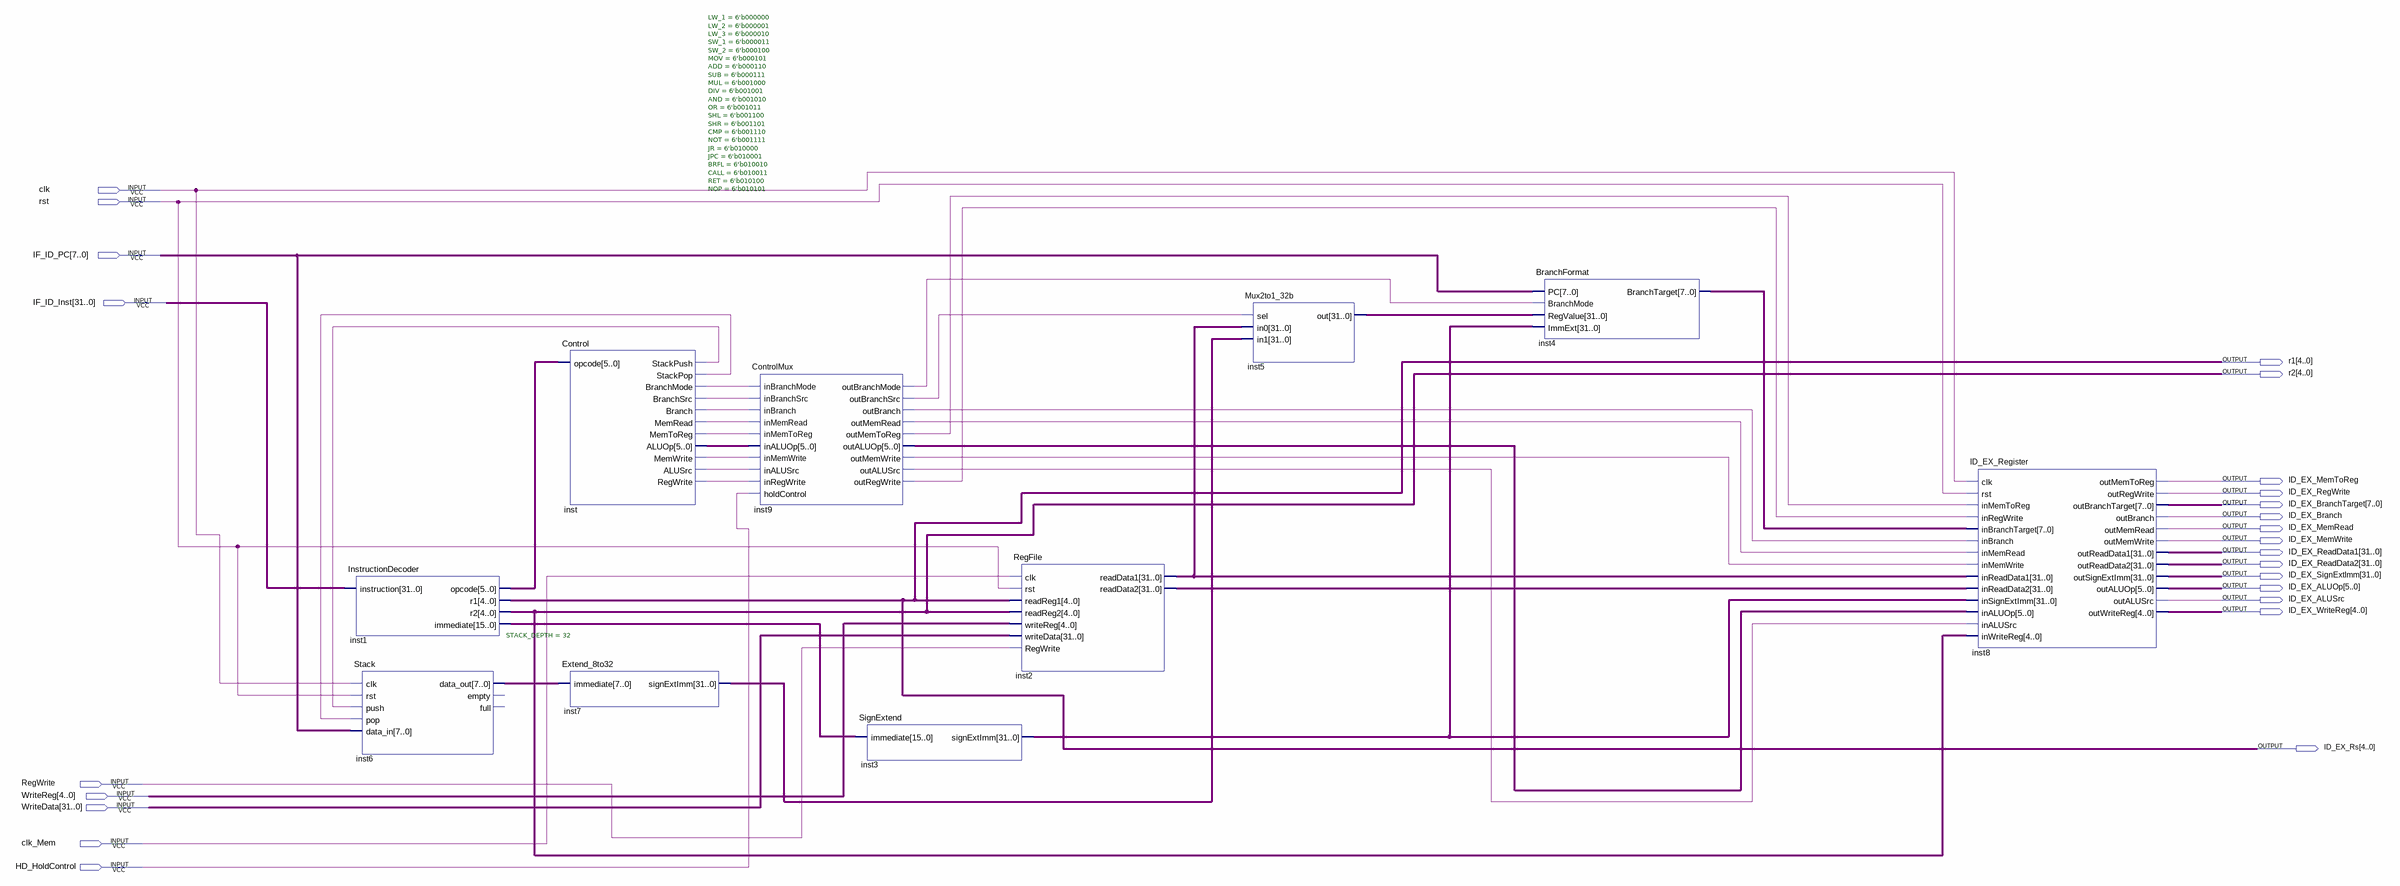
[diagram p0: schematic sheet]
// Quartus schematic ID_STAGE.bdf as structural Verilog: 10 symbols, 24 pins
module ID_STAGE (
  input  clk,
  input  rst,
  input  [7:0] IF_ID_PC,
  input  [31:0] IF_ID_Inst,
  input  RegWrite,
  input  [4:0] WriteReg,
  input  [31:0] WriteData,
  input  clk_Mem,
  input  HD_HoldControl,
  output [4:0] r1,
  output [4:0] r2,
  output ID_EX_MemToReg,
  output ID_EX_RegWrite,
  output [7:0] ID_EX_BranchTarget,
  output ID_EX_Branch,
  output ID_EX_MemRead,
  output ID_EX_MemWrite,
  output [31:0] ID_EX_ReadData1,
  output [31:0] ID_EX_ReadData2,
  output [31:0] ID_EX_SignExtImm,
  output [5:0] ID_EX_ALUOp,
  output ID_EX_ALUSrc,
  output [4:0] ID_EX_WriteReg,
  output [4:0] ID_EX_Rs
);

  wire inst9_outalusrc, inst9_outbranch, inst9_outbranchmode, inst9_outbranchsrc, inst9_outmemread,
       inst9_outmemtoreg, inst9_outmemwrite, inst9_outregwrite, inst_alusrc, inst_branch, inst_branchmode,
       inst_branchsrc, inst_memread, inst_memtoreg, inst_memwrite, inst_regwrite, inst_stackpop,
       inst_stackpush;
  wire [5:0] inst1_opcode, inst9_outaluop, inst_aluop;
  wire [7:0] inst4_branchtarget, inst6_data_out;
  wire [15:0] inst1_immediate;
  wire [31:0] inst2_readdata1, inst2_readdata2, inst3_signextimm, inst5_out, inst7_signextimm;

  InstructionDecoder inst1 (
    .instruction(IF_ID_Inst), .opcode(inst1_opcode), .r1(ID_EX_Rs), .r2(r2), .immediate(inst1_immediate));
  Stack #(.STACK_DEPTH(32)) inst6 (
    .clk(clk), .rst(rst), .push(inst_stackpush), .pop(inst_stackpop), .data_in(IF_ID_PC),
    .data_out(inst6_data_out));  // open: empty, full
  Control #(.LW_1(6'b000000), .LW_2(6'b000001), .LW_3(6'b000010), .SW_1(6'b000011), .SW_2(6'b000100), .MOV(6'b000101), .ADD(6'b000110), .SUB(6'b000111), .MUL(6'b001000), .DIV(6'b001001), .AND(6'b001010), .OR(6'b001011), .SHL(6'b001100), .SHR(6'b001101), .CMP(6'b001110), .NOT(6'b001111), .JR(6'b010000), .JPC(6'b010001), .BRFL(6'b010010), .CALL(6'b010011), .RET(6'b010100), .NOP(6'b010101)) inst (
    .opcode(inst1_opcode), .StackPush(inst_stackpush), .StackPop(inst_stackpop),
    .BranchMode(inst_branchmode), .BranchSrc(inst_branchsrc), .Branch(inst_branch), .MemRead(inst_memread),
    .MemToReg(inst_memtoreg), .ALUOp(inst_aluop), .MemWrite(inst_memwrite), .ALUSrc(inst_alusrc),
    .RegWrite(inst_regwrite));
  Extend_8to32 inst7 (.immediate(inst6_data_out), .signExtImm(inst7_signextimm));
  ControlMux inst9 (
    .inBranchMode(inst_branchmode), .inBranchSrc(inst_branchsrc), .inBranch(inst_branch),
    .inMemRead(inst_memread), .inMemToReg(inst_memtoreg), .inALUOp(inst_aluop), .inMemWrite(inst_memwrite),
    .inALUSrc(inst_alusrc), .inRegWrite(inst_regwrite), .holdControl(HD_HoldControl),
    .outBranchMode(inst9_outbranchmode), .outBranchSrc(inst9_outbranchsrc), .outBranch(inst9_outbranch),
    .outMemRead(inst9_outmemread), .outMemToReg(inst9_outmemtoreg), .outALUOp(inst9_outaluop),
    .outMemWrite(inst9_outmemwrite), .outALUSrc(inst9_outalusrc), .outRegWrite(inst9_outregwrite));
  SignExtend inst3 (.immediate(inst1_immediate), .signExtImm(inst3_signextimm));
  RegFile inst2 (
    .clk(clk_Mem), .rst(rst), .readReg1(ID_EX_Rs), .readReg2(r2), .writeReg(WriteReg), .writeData(WriteData),
    .RegWrite(RegWrite), .readData1(inst2_readdata1), .readData2(inst2_readdata2));
  Mux2to1_32b inst5 (.sel(inst9_outbranchsrc), .in0(inst2_readdata1), .in1(inst7_signextimm), .out(inst5_out));
  BranchFormat inst4 (
    .PC(IF_ID_PC), .BranchMode(inst9_outbranchmode), .RegValue(inst5_out), .ImmExt(inst3_signextimm),
    .BranchTarget(inst4_branchtarget));
  ID_EX_Register inst8 (
    .clk(clk), .rst(rst), .inMemToReg(inst9_outmemtoreg), .inRegWrite(inst9_outregwrite),
    .inBranchTarget(inst4_branchtarget), .inBranch(inst9_outbranch), .inMemRead(inst9_outmemread),
    .inMemWrite(inst9_outmemwrite), .inReadData1(inst2_readdata1), .inReadData2(inst2_readdata2),
    .inSignExtImm(inst3_signextimm), .inALUOp(inst9_outaluop), .inALUSrc(inst9_outalusrc), .inWriteReg(r2),
    .outMemToReg(ID_EX_MemToReg), .outRegWrite(ID_EX_RegWrite), .outBranchTarget(ID_EX_BranchTarget),
    .outBranch(ID_EX_Branch), .outMemRead(ID_EX_MemRead), .outMemWrite(ID_EX_MemWrite),
    .outReadData1(ID_EX_ReadData1), .outReadData2(ID_EX_ReadData2), .outSignExtImm(ID_EX_SignExtImm),
    .outALUOp(ID_EX_ALUOp), .outALUSrc(ID_EX_ALUSrc), .outWriteReg(ID_EX_WriteReg));

  assign r1 = ID_EX_Rs;
endmodule
